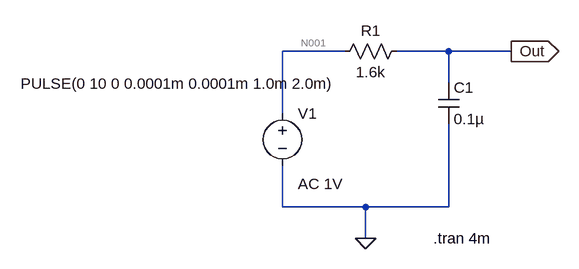
[diagram p0: schematic 25.1_5.rev-1.asc]
25.1_5.rev-1.asc, the LTspice schematic file:
Version 4
SHEET 1 880 680
WIRE 16 96 -80 96
WIRE 176 96 96 96
WIRE 272 96 176 96
WIRE 176 144 176 96
WIRE -80 192 -80 96
WIRE -80 336 -80 272
WIRE 48 336 -80 336
WIRE 176 336 176 208
WIRE 176 336 48 336
WIRE 48 384 48 336
FLAG 48 384 0
FLAG 272 96 Out
IOPIN 272 96 Out
SYMBOL cap 160 144 R0
SYMATTR InstName C1
SYMATTR Value 0.1µ
SYMBOL res 112 80 R90
WINDOW 0 0 56 VBottom 2
WINDOW 3 32 56 VTop 2
SYMATTR InstName R1
SYMATTR Value 1.6k
SYMBOL voltage -80 176 R0
WINDOW 123 24 124 Left 2
WINDOW 39 0 0 Left 2
WINDOW 3 -403 -30 Left 2
SYMATTR Value2 AC 1V
SYMATTR Value PULSE(0 10 0 0.0001m 0.0001m 1.0m 2.0m)
SYMATTR InstName V1
TEXT 152 384 Left 2 !.tran 4m

The netlist it stands for:
* 25.1_5.rev-1.asc
C1 Out 0 0.1µ
R1 Out N001 1.6k
V1 N001 0 PULSE(0 10 0 0.0001m 0.0001m 1.0m 2.0m) AC 1V
.tran 4m
.backanno
.end

* Results of the author's LTspice run, read from the files saved beside the schematic
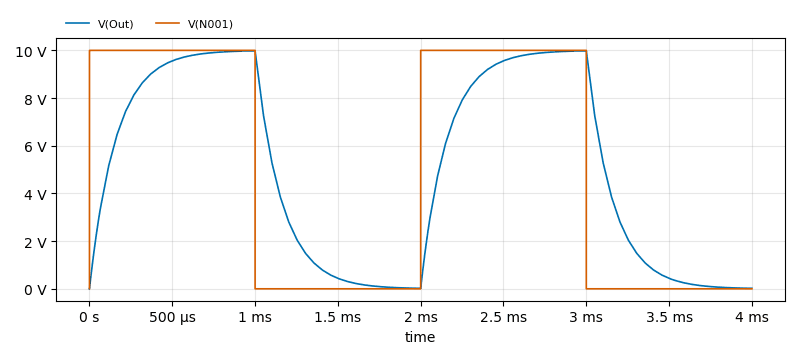
[diagram p1: Transient Analysis of 25.1_5.rev-1.asc, plotted from the saved traces]
* Transient Analysis, 1 run:
*   V(Out): min 0 V, max 9.981 V, average 5.002 V, rms 6.491 V, last 19.28 mV
*   V(N001): min 0 V, max 10 V, average 5.001 V, rms 7.071 V, last 0 V